# EAGLE design zumo_cam_02 (EAGLE 9.6.2)
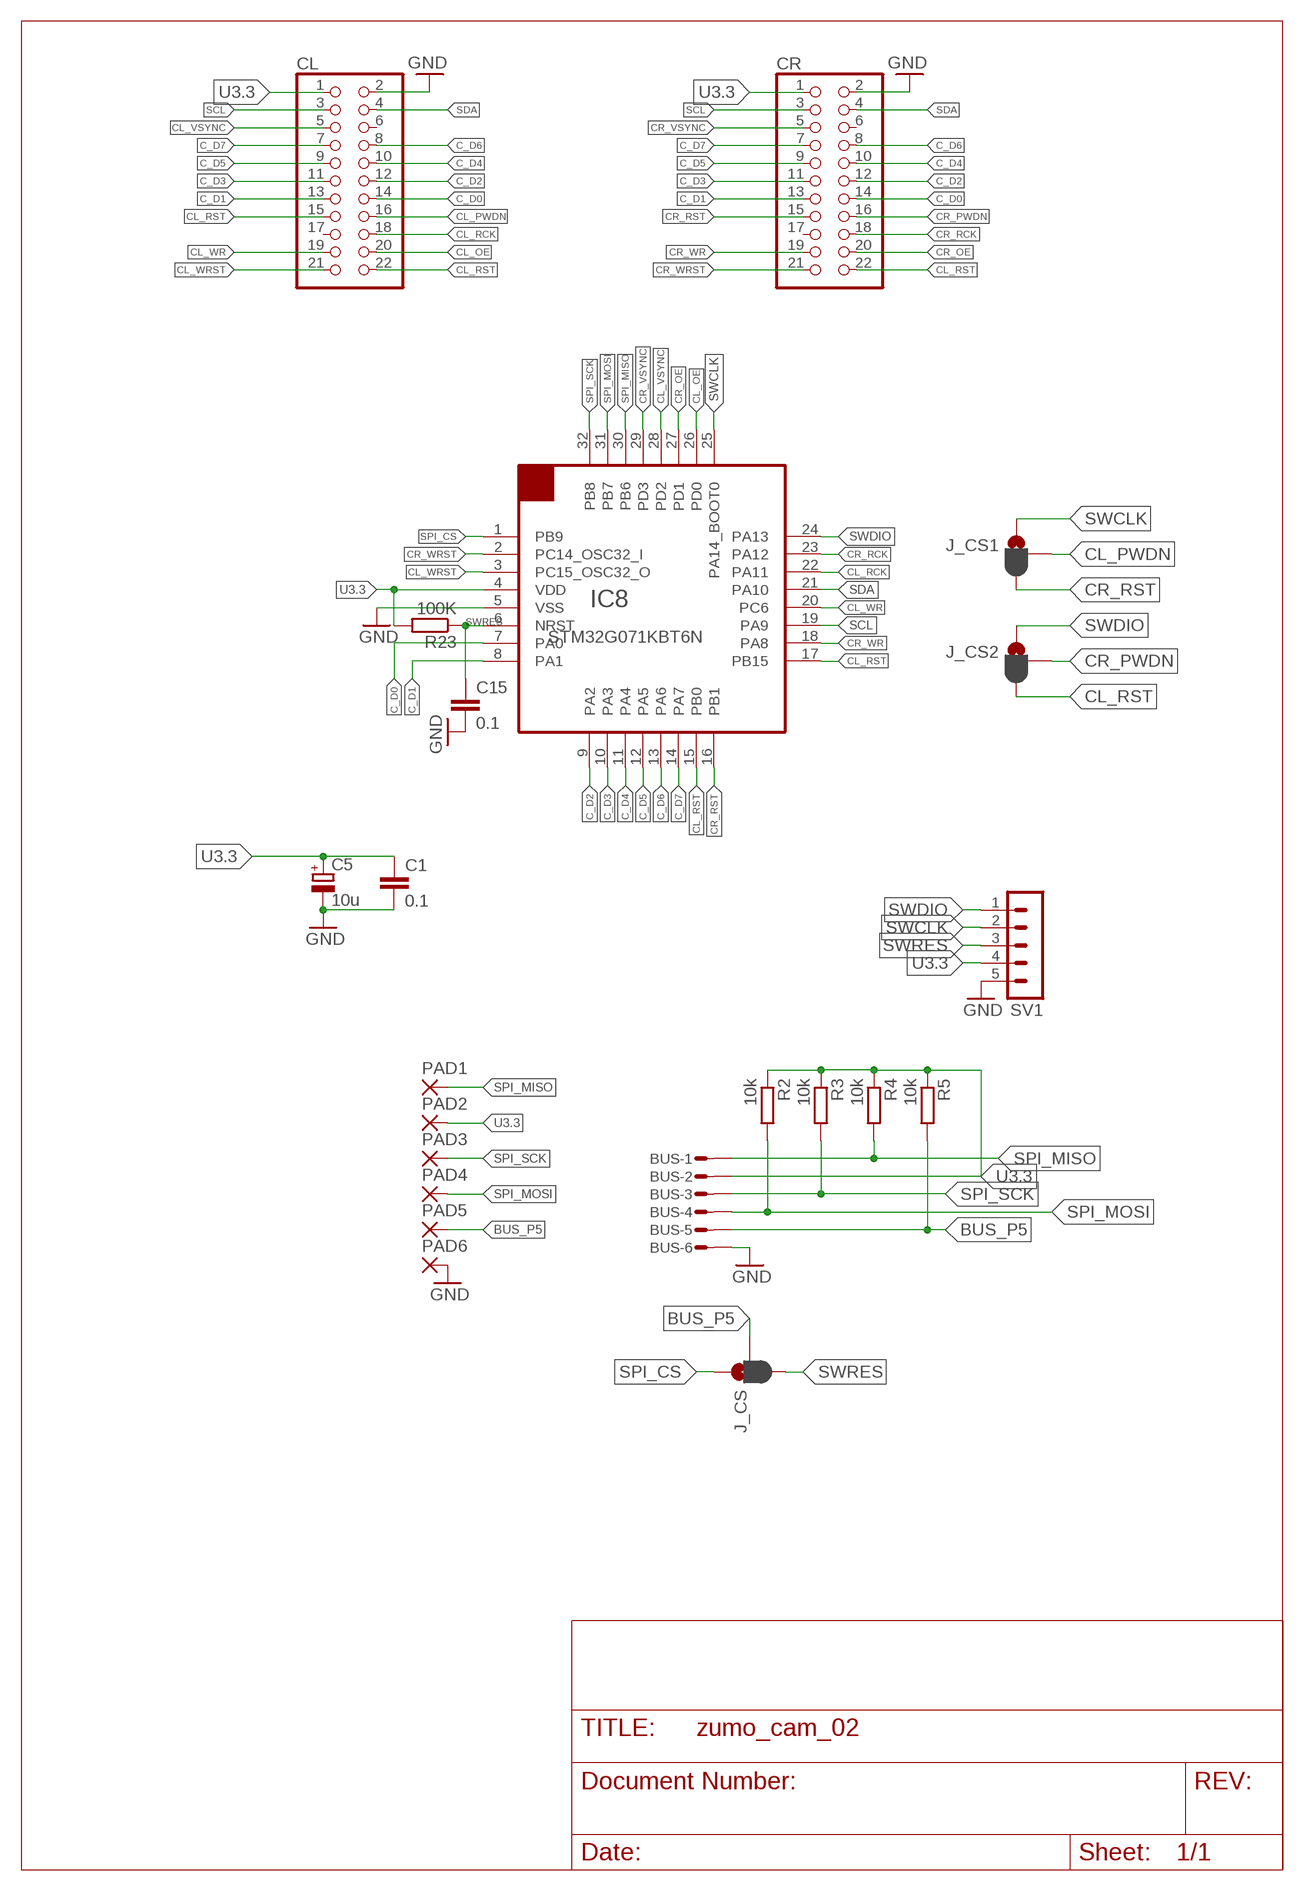
[diagram p0: schematic, sheet 1]

## Parts
BUS  MICROMATCH-6SMD  [MICROMATCH-6SMD]
C1  0.1  C-EUC0805  [C0805]
C5  10u  CPOL-EUB/3528-21W  [B/3528-21W]
C15  0.1  C-EUC0805  [C0805]
CL  PINHD-2X11_2.54-SMD  [2X11SMD]
CR  PINHD-2X11_2.54-SMD  [2X11SMD]
IC8  STM32G071KBT6N  [LQFP-32]
J_CS  JUMPER-SMT_3_1-NC_PASTE_NO-SILK  [SMT-JUMPER_3_1-NC_PASTE_NO-SILK]
J_CS1  JUMPER-SMT_3_1-NC_PASTE_NO-SILK  [SMT-JUMPER_3_1-NC_PASTE_NO-SILK]
J_CS2  JUMPER-SMT_3_1-NC_PASTE_NO-SILK  [SMT-JUMPER_3_1-NC_PASTE_NO-SILK]
PAD1  SMD2  [SMD1,27-2,54]
PAD2  SMD2  [SMD1,27-2,54]
PAD3  SMD2  [SMD1,27-2,54]
PAD4  SMD2  [SMD1,27-2,54]
PAD5  SMD2  [SMD1,27-2,54]
PAD6  SMD2  [SMD1,27-2,54]
R2  10k  R-EU_M0805  [M0805]
R3  10k  R-EU_M0805  [M0805]
R4  10k  R-EU_M0805  [M0805]
R5  10k  R-EU_M0805  [M0805]
R23  100K  R-EU_R0805  [R0805]
SV1  MA05-1  [MA05-1]

## Nets
BUS_P5: BUS.5 J_CS.2 PAD5.1(P) R5.2
C_D0: CL.14 CR.14 IC8.7(PA0)
C_D1: CL.13 CR.13 IC8.8(PA1)
C_D2: CL.12 CR.12 IC8.9(PA2)
C_D3: CL.11 CR.11 IC8.10(PA3)
C_D4: CL.10 CR.10 IC8.11(PA4)
C_D5: CL.9 CR.9 IC8.12(PA5)
C_D6: CL.8 CR.8 IC8.13(PA6)
C_D7: CL.7 CR.7 IC8.14(PA7)
CL_OE: CL.20 IC8.26(PD0)
CL_PWDN: CL.16 J_CS1.2
CL_RCK: CL.18 IC8.22(PA11)
CL_RST: CL.15 CL.22 CR.22 IC8.15(PB0) IC8.17(PB15) J_CS2.3
CL_VSYNC: CL.5 IC8.28(PD2)
CL_WR: CL.19 IC8.20(PC6)
CL_WRST: CL.21 IC8.3(PC15_OSC32_O)
CR_OE: CR.20 IC8.27(PD1)
CR_PWDN: CR.16 J_CS2.2
CR_RCK: CR.18 IC8.23(PA12)
CR_RST: CR.15 IC8.16(PB1) J_CS1.3
CR_VSYNC: CR.5 IC8.29(PD3)
CR_WR: CR.19 IC8.18(PA8)
CR_WRST: CR.21 IC8.2(PC14_OSC32_I)
GND [gnd]: BUS.6 C1.2 C5.- C15.2 CL.2 CR.2 IC8.5(VSS) PAD6.1(P) SV1.5
SCL: CL.3 CR.3 IC8.19(PA9)
SDA: CL.4 CR.4 IC8.21(PA10)
SPI_CS: IC8.1(PB9) J_CS.1
SPI_MISO: BUS.1 IC8.30(PB6) PAD1.1(P) R4.2
SPI_MOSI: BUS.4 IC8.31(PB7) PAD4.1(P) R2.2
SPI_SCK: BUS.3 IC8.32(PB8) PAD3.1(P) R3.2
SWCLK: IC8.25(PA14_BOOT0) J_CS1.1 SV1.2
SWDIO: IC8.24(PA13) J_CS2.1 SV1.1
SWRES: C15.1 IC8.6(NRST) J_CS.3 R23.1 SV1.3
U3.3 [power]: BUS.2 C1.1 C5.+ CL.1 CR.1 IC8.4(VDD) PAD2.1(P) R2.1 R3.1 R4.1 R5.1 R23.2 SV1.4
Unconnected: CL.6 CL.17 CR.6 CR.17

## Library data of the parts
BUS = con-amp-micromatch:MICROMATCH-6: MicroMaTch 6 7-215464-6 / 0-215464-6 Drawing Number C-215464 DDEController.pdf
C1 C15 = rcl:C-EU: CAPACITOR, European symbol
C5 = rcl:CPOL-EU: POLARIZED CAPACITOR, European symbol; SPICEPREFIX: C
CL CR = pinhead-1:PINHD-2X11: PIN HEADER
IC8 = stm32:STM32G071KBT6N
J_CS J_CS1 J_CS2 = SparkFun-Jumpers:JUMPER-SMT_3_1-NC_PASTE: Normally closed solder jumper (1 of 2 connections) This jumper has an aperture in the stencil to allow solder paste to bridge one of the two connections. One connection is normally closed (NC), while the other is normally open (NO). Wick off the solder to open the connection. Reapply solder to reclose the connection. Apply solder to the other side instead to change the current path.
PAD1-PAD6 = wirepad:SMD2: SMD PAD
R2-R5 = rcl:R-EU_: RESISTOR, European symbol; SPICEPREFIX: R
R23 = rcl:R-EU_: RESISTOR, European symbol
SV1 = con-lstb:MA05-1: PIN HEADER; OC_FARNELL: unknown; OC_NEWARK: unknown

## Net classes
1 gnd: width 0.381 mm, drill 0.381 mm
2 power: width 0.381 mm, drill 0.381 mm

## Board
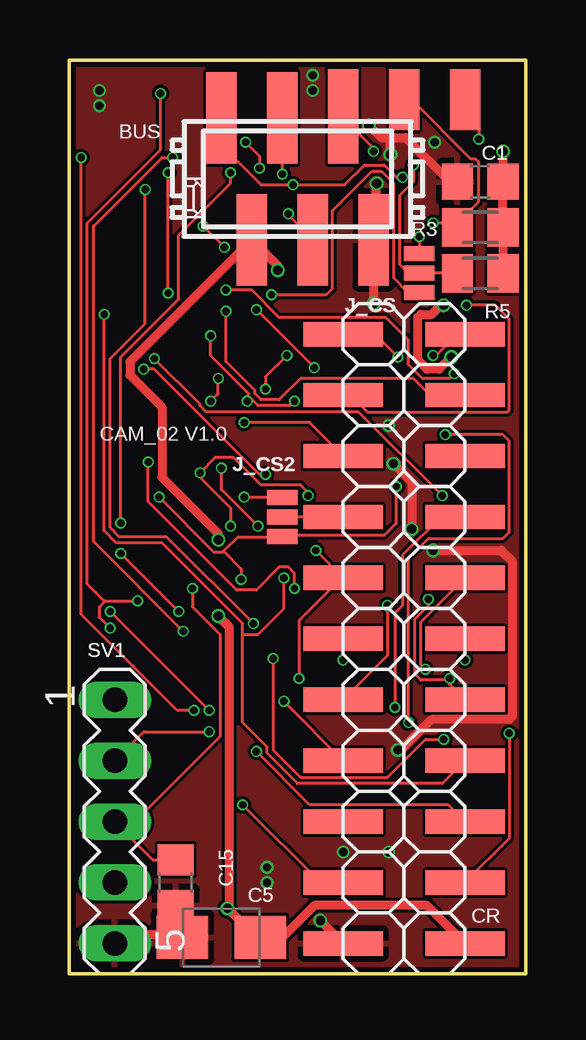
[diagram p1: board, top side]
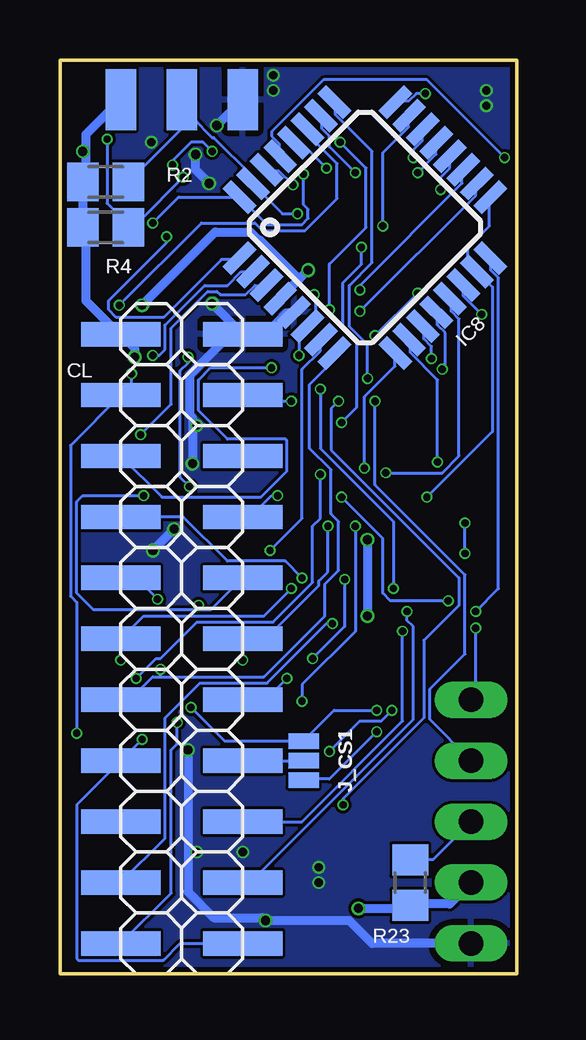
[diagram p2: board, bottom side, seen from below]

Size 19.05 x 38.1 mm. Coordinates in mm from the lower left corner, seen from the top.
Outline: 0,0 19.05,0 19.05,38.1 0,38.1 0,0
Copper layers (1*16): Top 0.035559375mm / dielectric 1.6mm / Bottom 0.035559375mm
Design rules "jlcpcb2layer": minimum track width 5mil, minimum drill 12mil, track to track 5mil, track to pad 5mil, pad to pad 5mil, via to via 5mil, smd to smd 5mil, copper to edge 8mil, drill to drill 6mil, minimum pad ring 5mil, minimum via ring 3mil, stop-mask expansion 2.5mil, vias tented up to drill 0mil, thermal gap 10mil

### Footprints (pad centres in the part's own frame; a part is rotated, then mirrored left to right if it is on the bottom)
MICROMATCH-6SMD = smd 1.27 x 3.81: 1 3.175,-2.54; 2 1.905,2.54; 3 0.635,-2.54; 4 -0.635,2.54; 5 -1.905,-2.54; 6 -3.175,2.54
C0805 = smd 1.3 x 1.5: 1 -0.95,0; 2 0.95,0
B/3528-21W = smd 2.15 x 1.8: + 1.625,0; - -1.625,0
2X11SMD = smd 1.016 x 3.302: 1 -1.27,-3.81; 2 -1.27,1.27; 3 1.27,-3.81; 4 1.27,1.27; 5 3.81,-3.81; 6 3.81,1.27; 7 6.35,-3.81; 8 6.35,1.27; 9 8.89,-3.81; 10 8.89,1.27; 11 11.43,-3.81; 12 11.43,1.27; 13 13.97,-3.81; 14 13.97,1.27; 15 16.51,-3.81; 16 16.51,1.27; 17 19.05,-3.81; 18 19.05,1.27; 19 21.59,-3.81; 20 21.59,1.27; 21 24.13,-3.81; 22 24.13,1.27
LQFP-32 = smd 1.5 x 0.5: 1 -1.8,0; 2 -1.8,-0.8; 3 -1.8,-1.6; 4 -1.8,-2.4; 5 -1.8,-3.2; 6 -1.8,-4; 7 -1.8,-4.8; 8 -1.8,-5.6; 17 7.4,-5.6; 18 7.4,-4.8; 19 7.4,-4; 20 7.4,-3.2; 21 7.4,-2.4; 22 7.4,-1.6; 23 7.4,-0.8; 24 7.4,0 | smd 0.5 x 1.5: 9 0,-7.4; 10 0.8,-7.4; 11 1.6,-7.4; 12 2.4,-7.4; 13 3.2,-7.4; 14 4,-7.4; 15 4.8,-7.4; 16 5.6,-7.4; 25 5.6,1.8; 26 4.8,1.8; 27 4,1.8; 28 3.2,1.8; 29 2.4,1.8; 30 1.6,1.8; 31 0.8,1.8; 32 0,1.8
SMT-JUMPER_3_1-NC_PASTE_NO-SILK = smd 0.635 x 1.27: 1 -0.813,0; 2 0,0; 3 0.813,0
SMD1,27-2,54 = smd 1.27 x 2.54: 1 0,0
M0805 = smd 1.3 x 1.6: 1 -0.95,0; 2 0.95,0
R0805 = smd 1.3 x 1.5: 1 -0.95,0; 2 0.95,0
MA05-1 = drill 1.016 long: 1 -5.08,0; 2 -2.54,0; 3 0,0; 4 2.54,0; 5 5.08,0

### Placement (x,y rotation side)
BUS  9.53,33.15 180 top
C1  17.14,33.02 180 top
C5  6.35,1.52 0 top
C15  4.45,3.81 270 top
CL  12.7,25.4 270 bottom
CR  12.7,2.54 90 top
IC8  10.29,31.11 45 bottom
J_CS  14.61,29.21 270 top
J_CS1  8.89,8.89 90 bottom
J_CS2  8.89,19.05 270 top
PAD1  16.51,36.45 0 top
PAD2  16.51,36.45 0 bottom
PAD3  13.97,36.45 0 top
PAD4  13.97,36.45 0 bottom
PAD5  11.43,36.45 0 top
PAD6  11.43,36.45 0 bottom
R2  17.14,33.02 0 bottom
R3  17.14,31.11 180 top
R4  17.14,31.11 0 bottom
R5  17.14,29.21 180 top
R23  4.45,3.81 270 bottom
SV1  1.91,6.35 270 top

### Tracks (layer width: path | path; a pad name or v marks a point on that pad's centre or on a via)
BUS_P5  (via drill 0.3)
  Top 0.127: R5.2 J_CS.2 14.16,29.21 13.78,29.59 13.78,32.45 14.35,33.02 v14.35,33.72 | v12.7,34.29 12.7,34.42 BUS.5 PAD5.1
  Bottom 0.127: v14.35,33.72 14.35,33.91 13.59,34.67 13.08,34.67 v12.7,34.29
C_D0  (via drill 0.3)
  Top 0.127: v10.29,17.65 CR.14 11.37,16.51 9.59,14.73 v9.59,12.32
  Bottom 0.127: v10.29,17.65 8.95,18.99 8.95,25.21 8.19,25.97 8.19,26.42 IC8.7 | CL.14 10.48,11.43 v9.59,12.32
C_D1  (via drill 0.3)
  Top 0.127: CR.13 14.67,14.67 14.67,12.89 v14.86,12.7
  Bottom 0.127: 14.86,12.38 15.18,12.38 16.13,11.43 CL.13 | 14.86,12.38 10.54,12.38 8,14.92 8,16.26 7.43,16.83 7.43,18.86 7.75,19.18 7.75,21.02 8.64,21.91 8.64,24.57 7.62,25.59 7.62,25.84 IC8.8 | 14.86,12.38 v14.86,12.7
C_D2  (via drill 0.3)
  Top 0.127: v6.35,21.08 6.35,20.19 v7.87,18.67 | v11.43,13.08 CR.12
  Bottom 0.127: v6.35,21.08 6.35,24.07 5.08,25.34 5.08,25.84 IC8.9 | v7.87,18.67 7.87,16.76 8.26,16.38 8.26,16.19 10.48,13.97 CR.12 v11.43,13.08
C_D3  (via drill 0.3)
  Top 0.127: v3.3,21.34 3.3,19.68 6.99,16 7.81,16 8.76,16.95 9.14,16.95 9.4,16.7 v9.4,16.07 | v16.51,13.08 CR.11
  Bottom 0.127: v3.3,21.34 3.3,24.77 4.45,25.91 4.45,26.42 IC8.10 | v9.4,16.07 10.54,14.92 15.56,14.92 CR.11 v16.51,13.08
C_D4  (via drill 0.3)
  Top 0.127: v3.56,25.65 5.46,23.75 5.46,23.69 5.71,23.43 12.06,23.43 v15.56,19.94 | CR.10 13.27,13.27 v13.27,15.37
  Bottom 0.127: v3.56,25.65 3.56,26.16 3.87,26.48 3.87,26.99 IC8.11 | v15.56,19.94 18.1,19.94 18.35,19.68 18.35,15.88 17.65,15.18 13.27,15.18 | 13.27,15.18 12.76,15.18 CL.10 | 13.27,15.18 v13.27,15.37
C_D5  (via drill 0.3)
  Top 0.127: v3.11,25.21 3.56,25.21 7.94,20.83 v8.19,20.83 | 15.88,12.26 15.88,12.06 CR.9 | v14.99,15.62 14.99,15.37 14.41,14.8 14.41,12.51 14.67,12.26 15.88,12.26 | 15.88,12.26 v15.88,12.32
  Bottom 0.127: v3.11,25.21 2.98,25.34 2.98,26.73 3.3,27.05 3.3,27.56 IC8.12 | v8.19,20.83 8.19,18.99 8.51,18.67 8.51,16.32 10.16,14.67 13.34,14.67 14.86,13.14 15.05,13.14 v15.88,12.32 | CL.9 15.88,16.51 v14.99,15.62
C_D6  (via drill 0.3)
  Top 0.127: v9.97,19.94 9.97,20.07 9.65,20.38 8,20.38 6.86,21.53 6.1,21.53 v5.46,20.89 5.52,20.89 5.52,20.64 6.73,19.43 v6.73,18.67 | v8.95,11.37 CR.8
  Bottom 0.127: v5.46,20.89 3.11,20.89 2.41,21.59 2.41,27.3 2.73,27.62 2.73,28.13 IC8.13 | v9.97,19.94 10.22,19.94 11.11,19.05 CL.8 | v8.95,11.37 8.95,12.06 6.73,14.29 v6.73,18.67
C_D7  (via drill 0.3)
  Top 0.127: v1.46,27.5 1.46,18.48 1.97,17.97 3.87,17.97 7.24,14.61 7.24,14.16 | 7.24,14.16 7.24,10.48 8.26,9.46 8.26,9.21 9.53,7.94 15.56,7.94 CR.7 | v8.95,16.51 8.95,15.24 7.87,14.16 7.24,14.16
  Bottom 0.127: v1.46,27.5 2.22,28.26 IC8.14 | CL.7 13.91,19.05 12.06,17.21 9.65,17.21 v8.95,16.51
CL_OE  (via drill 0.3)
  Top 0.127: v6.73,33.4 6.73,32.96 4.57,30.8 4.57,28.13 2.16,25.72 v2.16,18.8 | v4.57,15.11 v2.16,17.53
  Bottom 0.127: v6.73,33.4 7.81,34.48 7.81,34.92 8.13,35.24 8.13,35.75 IC8.26 | v2.16,17.53 v2.16,18.8 | v4.57,15.11 4.57,14.73 4.32,14.48 4.32,10.6 11.11,3.81 CL.20
CL_PWDN
  Bottom 0.127: CL.16 J_CS1.2
CL_RCK  (via drill 0.3)
  Top 0.127: v4.32,34.04 3.87,34.04 1.02,31.18 1.02,18.03 v4.76,14.29
  Bottom 0.127: v4.32,34.04 4.32,34.35 3.94,34.73 3.94,35.18 IC8.22 | v4.76,14.29 4.76,10.54 8.95,6.35 CL.18
CL_RST  (via drill 0.3)
  Top 0.127: 6.45,17.62 6.41,17.59 6.03,17.59 v3.75,19.88 | 6.45,17.62 7.05,18.22 8.89,18.22 J_CS2.3 8.89,18.29 13.14,18.29 13.65,18.8 v13.65,20.32 | CR.22 12.76,26.67 v13.72,25.72 | v15.62,9.78 14.86,9.78 13.27,8.19 9.65,8.19 8.51,9.34 v8.51,13.14 | v7.18,16.45 7.18,16.89 6.45,17.62
  Bottom 0.127: CL.22 14.03,1.27 14.73,0.57 18.29,0.57 18.35,0.64 18.35,7.05 CL.15 v15.62,9.78 | v3.75,19.88 1.02,22.61 1.02,28.64 IC8.15 1.71,29.34 2.03,29.65 2.03,30.29 1.14,31.18 1.14,32.38 IC8.17 | v13.72,25.72 13.72,25.46 14.03,25.15 14.03,20.7 v13.65,20.32 | v8.51,13.14 7.18,14.48 v7.18,16.45
CL_VSYNC  (via drill 0.3)
  Top 0.127: v7.94,33.59 7.94,34.1 v7.37,34.67 | v10.22,25.27 v7.81,27.69
  Bottom 0.127: v7.94,33.59 8.95,34.61 9.27,34.61 IC8.28 | v7.37,34.67 6.29,33.59 6.29,31.11 7.81,29.59 v7.81,27.69 | v10.22,25.27 12.76,25.27 13.27,24.77 13.27,23.5 12.06,22.29 9.65,22.29 9.59,22.23 9.59,20.95 10.67,19.88 14.8,19.88 CL.5
CL_WR  (via drill 0.3)
  Top 0.127: v3.17,32.7 3.17,27.11 1.71,25.65 1.71,18.61 2.1,18.22 4.06,18.22 v7.68,14.61
  Bottom 0.127: v3.17,32.7 3.17,33.21 2.79,33.59 2.79,34.04 IC8.20 | v7.68,14.61 7.94,14.61 10.41,12.13 13.21,12.13 14.67,10.67 14.67,5.65 CL.19
CL_WRST  (via drill 0.3)
  Top 0.127: v15.68,22.48 18.1,22.48 18.35,22.23 18.35,18.41 18.1,18.16 14.99,18.16 14.16,17.34 v14.16,10.48
  Bottom 0.127: v15.68,22.48 14.41,23.75 14.41,26.92 12.89,28.45 12.51,28.45 12.38,28.32 11.3,28.32 10.92,28.7 10.48,28.7 IC8.3 | v14.16,10.48 14.16,9.59 14.41,9.34 14.41,3.37 CL.21
CR_OE  (via drill 0.3)
  Top 0.127: v16.57,27.88 17.78,27.88 18.35,27.3 18.35,23.5 18.29,23.43 12.45,23.43 11.75,24.13 CR.20
  Bottom 0.127: v16.57,27.88 13.14,31.3 10.92,31.3 10.6,30.99 8.83,30.99 7.49,32.32 7.49,33.78 8.7,34.99 8.7,35.18 IC8.27
CR_PWDN
  Top 0.127: CR.16 J_CS2.2
CR_RCK  (via drill 0.3)
  Top 0.127: v6.48,30.29 v5.59,31.18 | v7.3,22.99 10.03,22.99 CR.18
  Bottom 0.127: v5.59,31.18 5.59,34.23 4.51,35.31 4.51,35.75 IC8.23 | v6.48,30.29 6.48,29.59 7.24,28.83 7.24,26.86 6.67,26.29 6.67,23.62 v7.3,22.99
CR_RST  (via drill 0.3)
  Top 0.127: v13.59,11.11 13.59,15.05 13.91,15.37 13.91,17.46 15.49,19.05 CR.15 | v5.84,10.99 v1.71,15.11
  Bottom 0.127: 8.89,9.72 12.19,9.72 v13.59,11.11 | v1.71,15.11 0.76,16.07 0.76,29.02 1.08,29.34 1.08,29.78 IC8.16 | v5.84,10.99 7.62,10.99 8.89,9.72 | 8.89,9.72 J_CS1.3
CR_VSYNC  (via drill 0.3)
  Top 0.127: v0.51,34.04 0.51,14.99 4.51,10.99 v5.21,10.99 | v7.81,9.27 10.03,7.05 15.81,7.05 CR.5
  Bottom 0.127: v0.51,34.04 3.75,37.27 8.06,37.27 10.22,35.12 10.22,34.92 9.91,34.61 9.91,34.1 IC8.29 | v5.21,10.99 5.65,10.54 6.54,10.54 v7.81,9.27
CR_WR  (via drill 0.3)
  Top 0.127: v6.54,27.62 6.54,25.53 7.75,24.32 7.75,24.19 8,23.94 8.76,23.94 9.65,24.83 14.35,24.83 15.05,24.13 CR.19
  Bottom 0.127: v6.54,27.62 1.71,32.45 1.71,32.89 IC8.18
CR_WRST  (via drill 0.3)
  Top 0.127: v15.18,25.78 15.3,25.78 16.19,26.67 CR.21
  Bottom 0.127: v15.18,25.78 14.92,25.78 14.67,26.04 14.67,27.05 13.02,28.7 12.06,28.7 11.49,29.27 11.05,29.27 IC8.2
GND  (via drill 0.35, 0.38)
  Top 0.381: C15.2 4.45,1.78 4.7,1.52 C5.- 4.32,1.65 2.29,1.65 SV1.5 | v10.48,2.22 CR.2 | C1.2 15.88,33.02 14.03,34.86 13.4,34.86 | 13.4,34.86 13.02,34.86 v12.51,35.37 | v12.7,27.94 BUS.6 12.83,30.73 v12.83,32.96 | v13.4,34.16 13.4,34.86 | v13.72,9.34 13.84,9.34 15.11,10.6 18.35,10.6 18.48,10.73 18.48,17.21 18.03,17.65 v15.18,17.65 | v14.29,18.54 14.29,20.51 v13.53,21.27
  Bottom 0.381: SV1.5 6.03,1.27 6.99,2.22 v10.48,2.22 10.6,2.35 12.64,2.35 13.72,3.43 v13.72,9.34 | PAD6.1 v12.51,35.37 | CL.2 10.48,26.67 9.59,27.56 9.34,27.56 IC8.5 | v12.7,27.94 CL.2 | v13.4,34.16 13.4,33.53 v12.83,32.96 | v14.29,18.54 v15.18,17.65 | v13.53,21.27 13.53,23.18 13.65,23.3 13.65,24.96 11.81,26.8 CL.2
  other vias: 8.26,4.45 8.26,3.81 13.34,5.08 11.43,5.08 1.27,36.2 1.27,36.83 13.34,22.86 10.16,36.83 10.16,37.47 15.24,34.67
  pour Bottom: 0,0 19.05,0 19.05,38.1 0,38.1
  pour Top: 0,0 19.05,0 19.05,38.1 0,38.1
SCL  (via drill 0.3)
  Top 0.127: v6.54,28.51 7.62,28.51 8.76,27.37 13.21,27.37 14.16,26.42 14.16,25.4 14.73,24.83 15.88,24.83 v16.07,25.02 | CR.3 18.35,5.65 v18.35,10.03
  Bottom 0.127: v6.54,28.51 6.54,28.7 2.29,32.96 2.29,33.47 IC8.19 | v16.07,25.02 16.07,24.57 CL.3 18.61,22.04 18.61,15.75 18.35,15.49 v18.35,10.03
SDA  (via drill 0.3)
  Top 0.127: v4.13,28.38 v4.13,33.4 | v5.91,26.61 5.91,25.78 7.49,24.19 7.49,24.07 7.56,24 | 7.56,24 7.87,23.69 9.21,23.69 v9.4,23.88 | CR.4 10.48,3.81 v7.24,7.05 | 7.56,24 v7.43,23.88
  Bottom 0.127: v4.13,33.4 3.37,34.16 3.37,34.61 IC8.21 | v5.91,26.61 v4.13,28.38 | v9.4,23.88 11.18,23.88 CL.4 | v7.24,7.05 7.24,7.3 3.87,10.67 3.87,13.91 2.41,15.37 2.41,16.51 7.75,21.84 7.75,23.56 v7.43,23.88
SPI_CS  (via drill 0.3)
  Top 0.127: v14.61,30.73 J_CS.1
  Bottom 0.127: v14.61,30.73 14.61,30.48 17.02,28.07 17.02,27.69 16.7,27.37 14.73,27.37 12.32,29.78 11.62,29.78 IC8.1
SPI_MISO  (via drill 0.3)
  Top 0.127: v17.08,34.8 17.08,35.88 PAD1.1 | BUS.1 6.35,34.54 8,32.89 v9.34,32.89 11.49,32.89 12.32,33.72 13.14,33.72 13.65,33.21 v13.91,33.21
  Bottom 0.127: v17.08,34.8 17.08,32.13 16.26,31.3 16.26,31.11 R4.2 16.26,31.37 15.75,31.37 v13.91,33.21 | v9.34,32.89 9.91,33.47 10.41,33.47 IC8.30
SPI_MOSI  (via drill 0.3)
  Top 0.127: BUS.4 9.14,31.62 v9.14,31.69
  Bottom 0.127: 13.53,35.69 13.97,36.13 PAD4.1 13.53,35.69 | 13.53,35.69 12.7,34.86 12.64,34.86 11.05,33.27 11.05,32.96 IC8.31 10.99,32.89 9.78,31.69 v9.14,31.69 | 13.53,35.69 R2.2
SPI_SCK  (via drill 0.3)
  Top 0.127: v15.18,31.3 16,31.3 R3.2 16.13,31.24 17.08,32.19 17.08,33.85 16.95,33.97 16.76,33.97 14.29,36.45 PAD3.1 | v8.89,33.34 BUS.3
  Bottom 0.127: v15.18,31.3 14.1,32.38 11.62,32.38 IC8.32 10.41,31.24 8.95,31.24 8.7,31.5 8.7,31.88 8.89,32.07 v8.89,33.34
SWCLK  (via drill 0.3)
  Top 0.127: v5.84,10.1 3.11,10.1 SV1.2 | v6.22,24.83 6.22,24.19 v5.91,23.88
  Bottom 0.127: v5.84,10.1 7.81,8.13 8.89,8.13 J_CS1.1 | v6.22,24.83 6.22,26.23 6.99,26.99 6.99,28.7 6.03,29.65 6.03,34.29 7.56,35.81 7.56,36.32 IC8.25 | v5.91,23.88 5.91,20.38 2.16,16.64 2.16,13.34 3.62,11.87 3.62,10.6 SV1.2
SWDIO  (via drill 0.3)
  Top 0.127: v7.3,19.88 8.89,19.88 J_CS2.1 | v2.86,15.56 1.52,15.56 1.49,15.53 | 1.49,15.53 1.27,15.3 1.27,14.86 v1.71,14.41 | v3.81,36.7 3.81,34.35 0.76,31.3 0.76,16.26 1.49,15.53
  Bottom 0.127: v7.3,19.88 5.59,18.16 5.59,15.88 5.27,15.56 v2.86,15.56 | v1.71,14.41 1.71,11.62 SV1.1 | v3.81,36.7 4.19,36.7 4.51,36.39 5.02,36.39 IC8.24
SWRES  (via drill 0.3)
  Top 0.127: C15.1 3.49,4.76 SV1.3 2.35,5.97 6.29,9.91 6.29,14.16 5.14,15.3 v5.14,16.07 | v8.45,28.32 10.73,28.32 10.99,28.57 10.99,31.81 12.64,33.47 13.02,33.47 13.53,32.96 13.53,29.02 14.1,28.45 14.61,28.45 J_CS.3 | v8.19,24.38 8.19,24.89 v9.08,25.78
  Bottom 0.127: SV1.3 3.49,4.76 C15.1 | v8.45,28.32 8.45,28.07 8.38,28 8.38,27.37 8.7,27.05 IC8.6 8.76,26.99 9.08,26.67 v9.08,25.78 | v5.14,16.07 5.14,18.86 8.19,21.91 v8.19,24.38
U3.3  (via drill 0.38)
  Top 0.381: CR.1 14.92,2.86 10.22,2.86 8.89,1.52 C5.+ 7.81,1.52 v6.6,2.73 6.67,2.86 6.67,14.48 v6.22,14.92 | v8.7,29.34 8.7,29.53 BUS.2 2.54,25.53 2.54,24.96 3.87,23.62 3.87,20.7 6.22,18.35 v6.22,18.1 | R5.1 18.1,30.99 R4.1 C1.1 18.1,33.15 v18.1,34.29 | v15.62,27.88 15.49,27.88 15.11,27.5 14.67,27.5 14.54,27.37 14.54,25.59 14.92,25.21 15.43,25.21 v15.94,25.72
  Bottom 0.381: SV1.4 2.79,2.92 4.45,2.92 R23.2 4.57,2.73 v6.6,2.73 | v8.7,29.34 9.08,28.96 | 9.08,28.96 9.84,28.19 IC8.4 | 17.97,34.29 17.97,34.99 PAD2.1 | 17.97,34.29 17.97,33.15 C1.1 R4.1 17.97,30.99 17.97,28.07 16.89,26.99 16.83,26.99 CL.1 15.94,26.1 v15.94,25.72 | v18.1,34.29 17.97,34.29 | 9.08,28.96 10.73,30.61 10.79,30.61 11.11,30.92 12.57,30.92 v15.62,27.88 | v6.22,18.1 v6.22,14.92

### Text on the board
tPlace: CAM_02 V1.0
_tNames: BUS | C1 | R3 | J_CS | R5 | J_CS2 | SV1 | C15 | C5 | CR
_bNames: R2 | R4 | IC8 | CL | J_CS1 | R23